# Altium schematic sheet KIT_STM32F4.SchDoc
size A
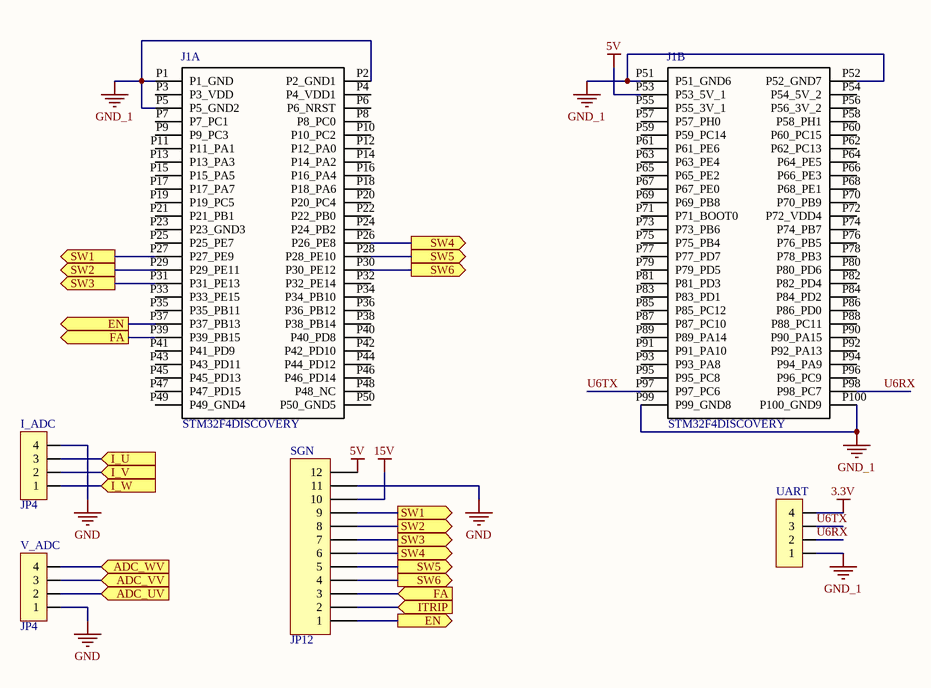
[diagram p0: KIT_STM32F4.SchDoc]

## Parts
I_ADC  JP4  [JP4-C1T]
J1  STM32F4DISCOVERY  [STMICROELECTRONICS_STM32F4DISCOVERY_STM32F4DISCOVERY(Primary)]  (parts A,B of 2)
SGN  JP12  [JP12-D1T]
UART  JP4  [JP4-C1T]  (value not drawn)
V_ADC  JP4  [JP4-C1T]

## Ports
ADC_UV (in), ADC_VV (in), ADC_WV (in), EN (out), FA (in), FA (out), I_U (in), I_V (in), I_W (in), ITRIP (in), SW1 (out), SW2 (out), SW3 (out), SW4 (out), SW5 (out), SW6 (out)

## Nets
3.3V: UART.4
5V: J1.P53(P53_5V_1) SGN.12
15V: SGN.10
GND: I_ADC.4 SGN.11 V_ADC.1
GND_1: J1.P1(P1_GND) J1.P2(P2_GND1) J1.P5(P5_GND2) J1.P51(P51_GND6) J1.P52(P52_GND7) J1.P99(P99_GND8) J1.P100(P100_GND9) UART.1
ADC_UV: V_ADC.2 ; port ADC_UV
ADC_VV: V_ADC.3 ; port ADC_VV
ADC_WV: V_ADC.4 ; port ADC_WV
EN: J1.P37(P37_PB13) SGN.1 ; port EN
FA: J1.P39(P39_PB15) SGN.3 ; port FA
I_U: I_ADC.3 ; port I_U
I_V: I_ADC.2 ; port I_V
I_W: I_ADC.1 ; port I_W
ITRIP: SGN.2 ; port ITRIP
SW1: J1.P27(P27_PE9) SGN.9 ; port SW1
SW2: J1.P29(P29_PE11) SGN.8 ; port SW2
SW3: J1.P31(P31_PE13) SGN.7 ; port SW3
SW4: J1.P26(P26_PE8) SGN.6 ; port SW4
SW5: J1.P28(P28_PE10) SGN.5 ; port SW5
SW6: J1.P30(P30_PE12) SGN.4 ; port SW6
U6RX: J1.P98(P98_PC7) UART.2
U6TX: J1.P97(P97_PC6) UART.3

Not connected (* = marked no-connect by the designer): J1 P3(P3_VDD) P4(P4_VDD1) P6(P6_NRST) P7(P7_PC1) P8(P8_PC0) P9(P9_PC3) P10(P10_PC2) P11(P11_PA1) P12(P12_PA0) P13(P13_PA3) P14(P14_PA2) P15(P15_PA5) P16(P16_PA4) P17(P17_PA7) P18(P18_PA6) P19(P19_PC5) P20(P20_PC4) P21(P21_PB1) P22(P22_PB0) P23(P23_GND3) P24(P24_PB2) P25(P25_PE7) P32(P32_PE14) P33(P33_PE15) P34(P34_PB10) P35(P35_PB11) P36(P36_PB12) P38(P38_PB14) P40(P40_PD8) P41(P41_PD9) P42(P42_PD10) P43(P43_PD11) P44(P44_PD12) P45(P45_PD13) P46(P46_PD14) P47(P47_PD15) P48(P48_NC) P49(P49_GND4) P50(P50_GND5) P54(P54_5V_2) P55(P55_3V_1) P56(P56_3V_2) P57(P57_PH0) P58(P58_PH1) P59(P59_PC14) P60(P60_PC15) P61(P61_PE6) P62(P62_PC13) P63(P63_PE4) P64(P64_PE5) P65(P65_PE2) P66(P66_PE3) P67(P67_PE0) P68(P68_PE1) P69(P69_PB8) P70(P70_PB9) P71(P71_BOOT0) P72(P72_VDD4) P73(P73_PB6) P74(P74_PB7) P75(P75_PB4) P76(P76_PB5) P77(P77_PD7) P78(P78_PB3) P79(P79_PD5) P80(P80_PD6) P81(P81_PD3) P82(P82_PD4) P83(P83_PD1) P84(P84_PD2) P85(P85_PC12) P86(P86_PD0) P87(P87_PC10) P88(P88_PC11) P89(P89_PA14) P90(P90_PA15) P91(P91_PA10) P92(P92_PA13) P93(P93_PA8) P94(P94_PA9) P95(P95_PC8) P96(P96_PC9)

## Library data of the parts
I_ADC UART V_ADC = JP4: WR-PHD 2.54 mm Angled Socket Header; Manufacturer: W¨¹rth Elektronik eiSos GmbH; partNo: 613004143121; ComponentLink1 Description: Manufacturer; ComponentLink2 Description: Datasheet; NoPins: 04; Created Date: 29 March 2013; ComponentLink1URL: http://www.we-online.com; ComponentLink2URL: http://katalog.we-online.de/em/datasheet/6130xx143121.pdf; Created by: Karrer Zheng
J1 = STM32F4DISCOVERY: Development kit: ARM ST; pin strips, pin header; No.of; MF: STMicroelectronics; Package: None; MP: STM32F4DISCOVERY; Price: None; Availability: Unavailable; SnapEDA_Link: https://www.snapeda.com/parts/STM32F4DISCOVERY/STMicroelectronics/view-part/?ref=snap; Value: *
SGN = JP12: WR-PHD 2.54 mm Angled Socket Header; Manufacturer: W¨¹rth Elektronik eiSos GmbH; partNo: 613012143121; ComponentLink1 Description: Manufacturer; ComponentLink2 Description: Datasheet; NoPins: 12; Created Date: 29 March 2013; ComponentLink1URL: http://www.we-online.com; ComponentLink2URL: http://katalog.we-online.de/em/datasheet/6130xx143121.pdf; Created by: Karrer Zheng